# EAGLE schematic Bike (EAGLE 6.5.0)
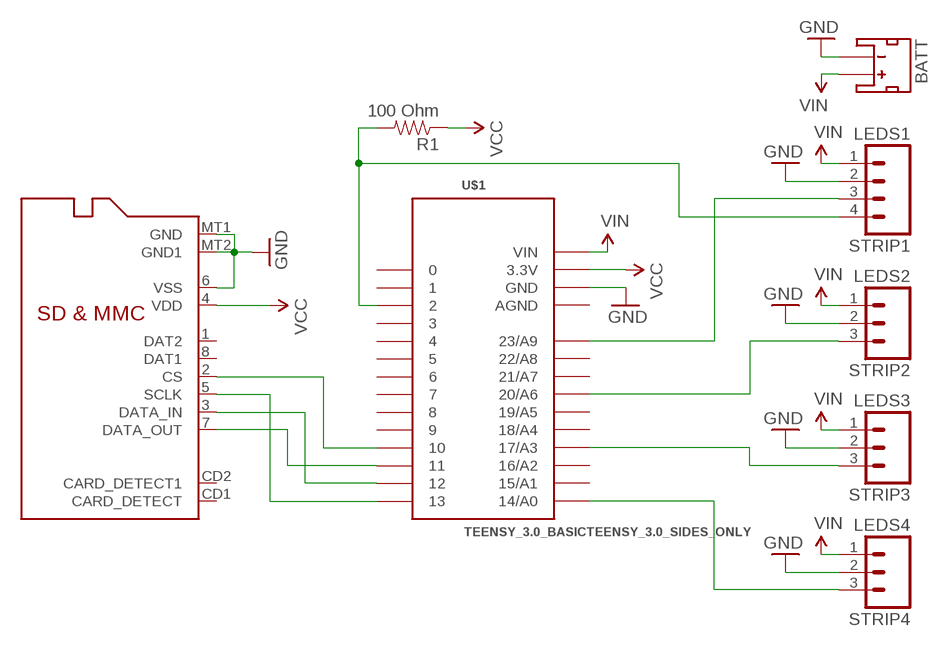
[diagram p0: schematic, sheet 1]

## Parts
BATT  3.7V  JST_2MM_MALE  [JST-2-SMD]
R1  100 Ohm  RESISTOREZ  [AXIAL-0.3EZ]
SD  MICROSD  [MICROSD]
STRIP1  LEDS1  M04JST-PTH  [JST-4-PTH]
STRIP2  LEDS2  M03JST-PTH  [JST-3-PTH]
STRIP3  LEDS3  M03JST-PTH  [JST-3-PTH]
STRIP4  LEDS4  M03JST-PTH  [JST-3-PTH]
U$1  TEENSY_3.0_BASICTEENSY_3.0_SIDES_ONLY  [TEENSY_3.0_BASIC]

## Nets
GND: BATT.1(-) SD.6(VSS) SD.MT1(GND) SD.MT2(GND1) STRIP1.2 STRIP2.2 STRIP3.2 STRIP4.2 U$1.GND
N$1: STRIP3.3 U$1.17/A3
N$2: SD.3(DATA_IN) U$1.12
N$3: SD.7(DATA_OUT) U$1.11
N$4: SD.2(CS) U$1.10
N$5: SD.5(SCLK) U$1.13
N$6: STRIP4.3 U$1.14/A0
N$7: R1.P$2 STRIP1.4 U$1.2
N$8: STRIP2.3 U$1.20/A6
N$9: STRIP1.3 U$1.23/A9
VCC: R1.P$1 SD.4(VDD) U$1.3.3V
VIN: BATT.2(+) STRIP1.1 STRIP2.1 STRIP3.1 STRIP4.1 U$1.VIN
Unconnected: BATT.NC1(PAD1) BATT.NC2(PAD2) SD.1(DAT2) SD.8(DAT1) SD.CD1(CARD_DETECT) SD.CD2(CARD_DETECT1) U$1.0 U$1.1 U$1.3 U$1.4 U$1.5 U$1.6 U$1.7 U$1.8 U$1.9 U$1.15/A1 U$1.16/A2 U$1.18/A4 U$1.19/A5 U$1.21/A7 U$1.22/A8

## Power pins joined to a net without a drawn wire
AGND: U$1.AGND

## Library data of the parts
BATT = SparkFun-Connectors:JST_2MM_MALE: Mates to single-cell LiPo batteries. CONN-08352; PROD_ID: CONN-08352
R1 = SparkFun-Resistors:RESISTOR: Resistor Basic schematic elements and footprints for 0603, 1206, and PTH resistors.
SD = adafruit:MICROSD: Micro-SD / Transflash card holder with SPI pinout For the 3M # 2908-05WB-MG and/or 4UCON #19656 push-push type
STRIP1 = SparkFun-Connectors:M04: Header 4 Standard 4-pin 0.1" header. Use with straight break away headers (SKU : PRT-00116), right angle break away headers (PRT-00553), swiss pins (PRT-00743), machine pins (PRT-00117), and female headers (PRT-00115). Molex polarized connector foot print use with SKU : PRT-08231 with associated crimp pins and housings. 1MM SMD Version SKU: PRT-10208; SKU: PRT-09916
STRIP2-STRIP4 = SparkFun-Connectors:M03: Header 3 Standard 3-pin 0.1" header. Use with straight break away headers (SKU : PRT-00116), right angle break away headers (PRT-00553), swiss pins (PRT-00743), machine pins (PRT-00117), and female headers (PRT-00115). Molex polarized connector foot print use with SKU : PRT-08232 with associated crimp pins and housings.; SKU: PRT-09915
U$1 = staugaard:TEENSY_3.0_BASIC: Basic Teensy 3.0 with none of the 'inner' pins enabled. See '+4', 'AllAnalogPins", and 'AllPins' packages for additional pin holes, as needed.